# Altium schematic sheet FULL_CB_Servo_REV_C.SchDoc
size A4; DrawnBy: Philip Rowse
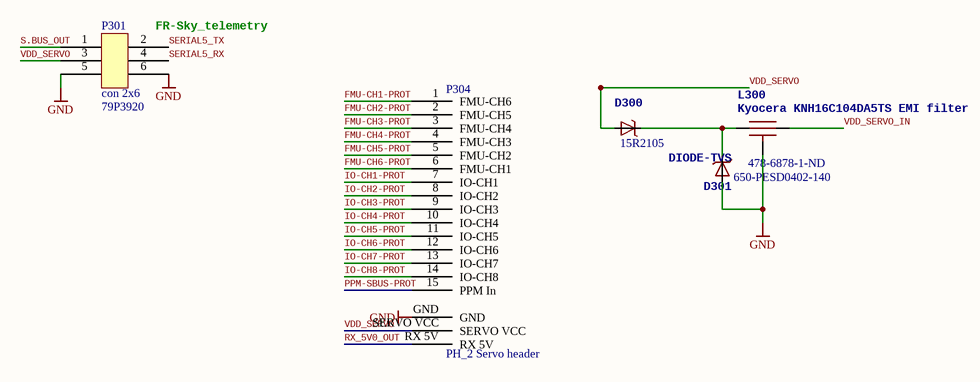
[diagram p0: FULL_CB_Servo_REV_C.SchDoc]

## Parts
D300  Supplier Part Number 1: 15R2105  [MICROSMP]  (hidden comment: MSS1P4-M3)
D301  DIODE-TVS  Supplier Part Number 1: 650-PESD0402-140  [0402-TVS]
L300  Kyocera KNH16C104DA5TS EMI filter  Supplier Part Number 1: 478-6878-1-ND  [KYOCERA-KNH16-DA]
P301  con 2x6  Supplier Part Number 1: 79P3920  [TSW-103-07-G-D]
P304  PH_2 Servo header  [TSW-115-08-G-T-RA]

## Nets
GND: D301.A L300.GND P301.5 P301.6 P304.GND
FMU-CH1-PROT: P304.1(FMU-CH6)
FMU-CH2-PROT: P304.2(FMU-CH5)
FMU-CH3-PROT: P304.3(FMU-CH4)
FMU-CH4-PROT: P304.4(FMU-CH3)
FMU-CH5-PROT: P304.5(FMU-CH2)
FMU-CH6-PROT: P304.6(FMU-CH1)
IO-CH1-PROT: P304.7(IO-CH1)
IO-CH2-PROT: P304.8(IO-CH2)
IO-CH3-PROT: P304.9(IO-CH3)
IO-CH4-PROT: P304.10(IO-CH4)
IO-CH5-PROT: P304.11(IO-CH5)
IO-CH6-PROT: P304.12(IO-CH6)
IO-CH7-PROT: P304.13(IO-CH7)
IO-CH8-PROT: P304.14(IO-CH8)
PPM-SBUS-PROT: P304.15(PPM_In)
RX_5V0_OUT: P304.RX_5V
S.BUS_OUT: P301.1
SERIAL5_RX: P301.4
SERIAL5_TX: P301.2
VDD_SERVO: D300.ANODE(A) P301.3 P304.SERVO_VCC
VDD_SERVO_IN: L300.P$2
NetD300_CATHODE: D300.CATHODE(C) D301.C L300.P$1

## Notes on the sheet
- (near P301) FR-Sky_telemetry
- Title
- Size:
- Date:
- A4
- Number:
- Time:
- Revision:
- Sheet
- of
- File:

## Library data of the parts
D300 = DIODE-SCHOTTKY_MSMP: Diode, Schottky, 40V, 1A, MicroSMP, SMD; Supplier 1: Newark
D301 = DIODE-TVS: Diode, TVS, 14VWM, 40VC, 0402, SMD; Supplier 1: Mouser
L300 = KNH16C104DA5TS: Capacitor, Filter, 0.1uF, 25V, 2A, 0603, SMD; Supplier 1: Digi-Key
P301 = con 2x6: Connector, Header, 6Pos, 2.54MM, Vert, THT, Au; Supplier 1: Newark
P304 = PH_2 Servo header: Connector, Header, 45Pos, 2.54MM, R/A, THT, Tin